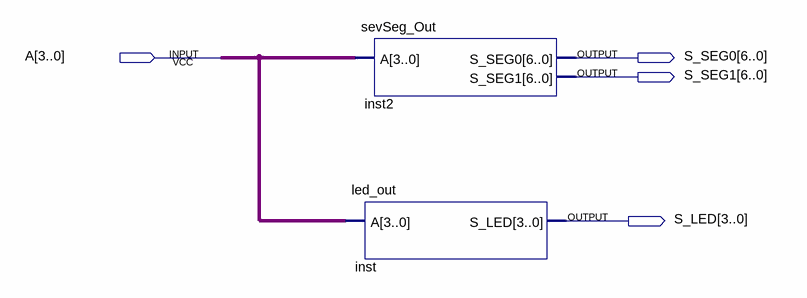
[diagram p0: schematic sheet]
// Quartus schematic Saida.bdf as structural Verilog: 2 symbols, 4 pins
module Saida (
  input  [3:0] A,
  output [6:0] S_SEG0,
  output [6:0] S_SEG1,
  output [3:0] S_LED
);

  sevSeg_Out inst2 (.A(A), .S_SEG0(S_SEG0), .S_SEG1(S_SEG1));
  led_out inst (.A(A), .S_LED(S_LED));
endmodule
